# Altium schematic sheet Coil_Driver_Rev_A-PCH-2.SchDoc: PCH
size B; Author: KR; DocumentNumber: 12282021; Revision: A; SheetNumber: 3; SheetTotal: 3; PageSetup: Record=PageOptions|CenterHorizontal=True|CenterVertical=True|PrintScale=0.95|XCorrection=1.00|YCorrection=1.00|PrintKind=1|BorderSize=5000000|LeftOffset=0|BottomOffset=0|Orientation=2|PaperLength=1000|PaperWidth=1000|Scale=100|PaperSource=7|PrintQuality=-4|MediaType=1|DitherType=10|PaperKind=Letter|PrintScaleMode=1
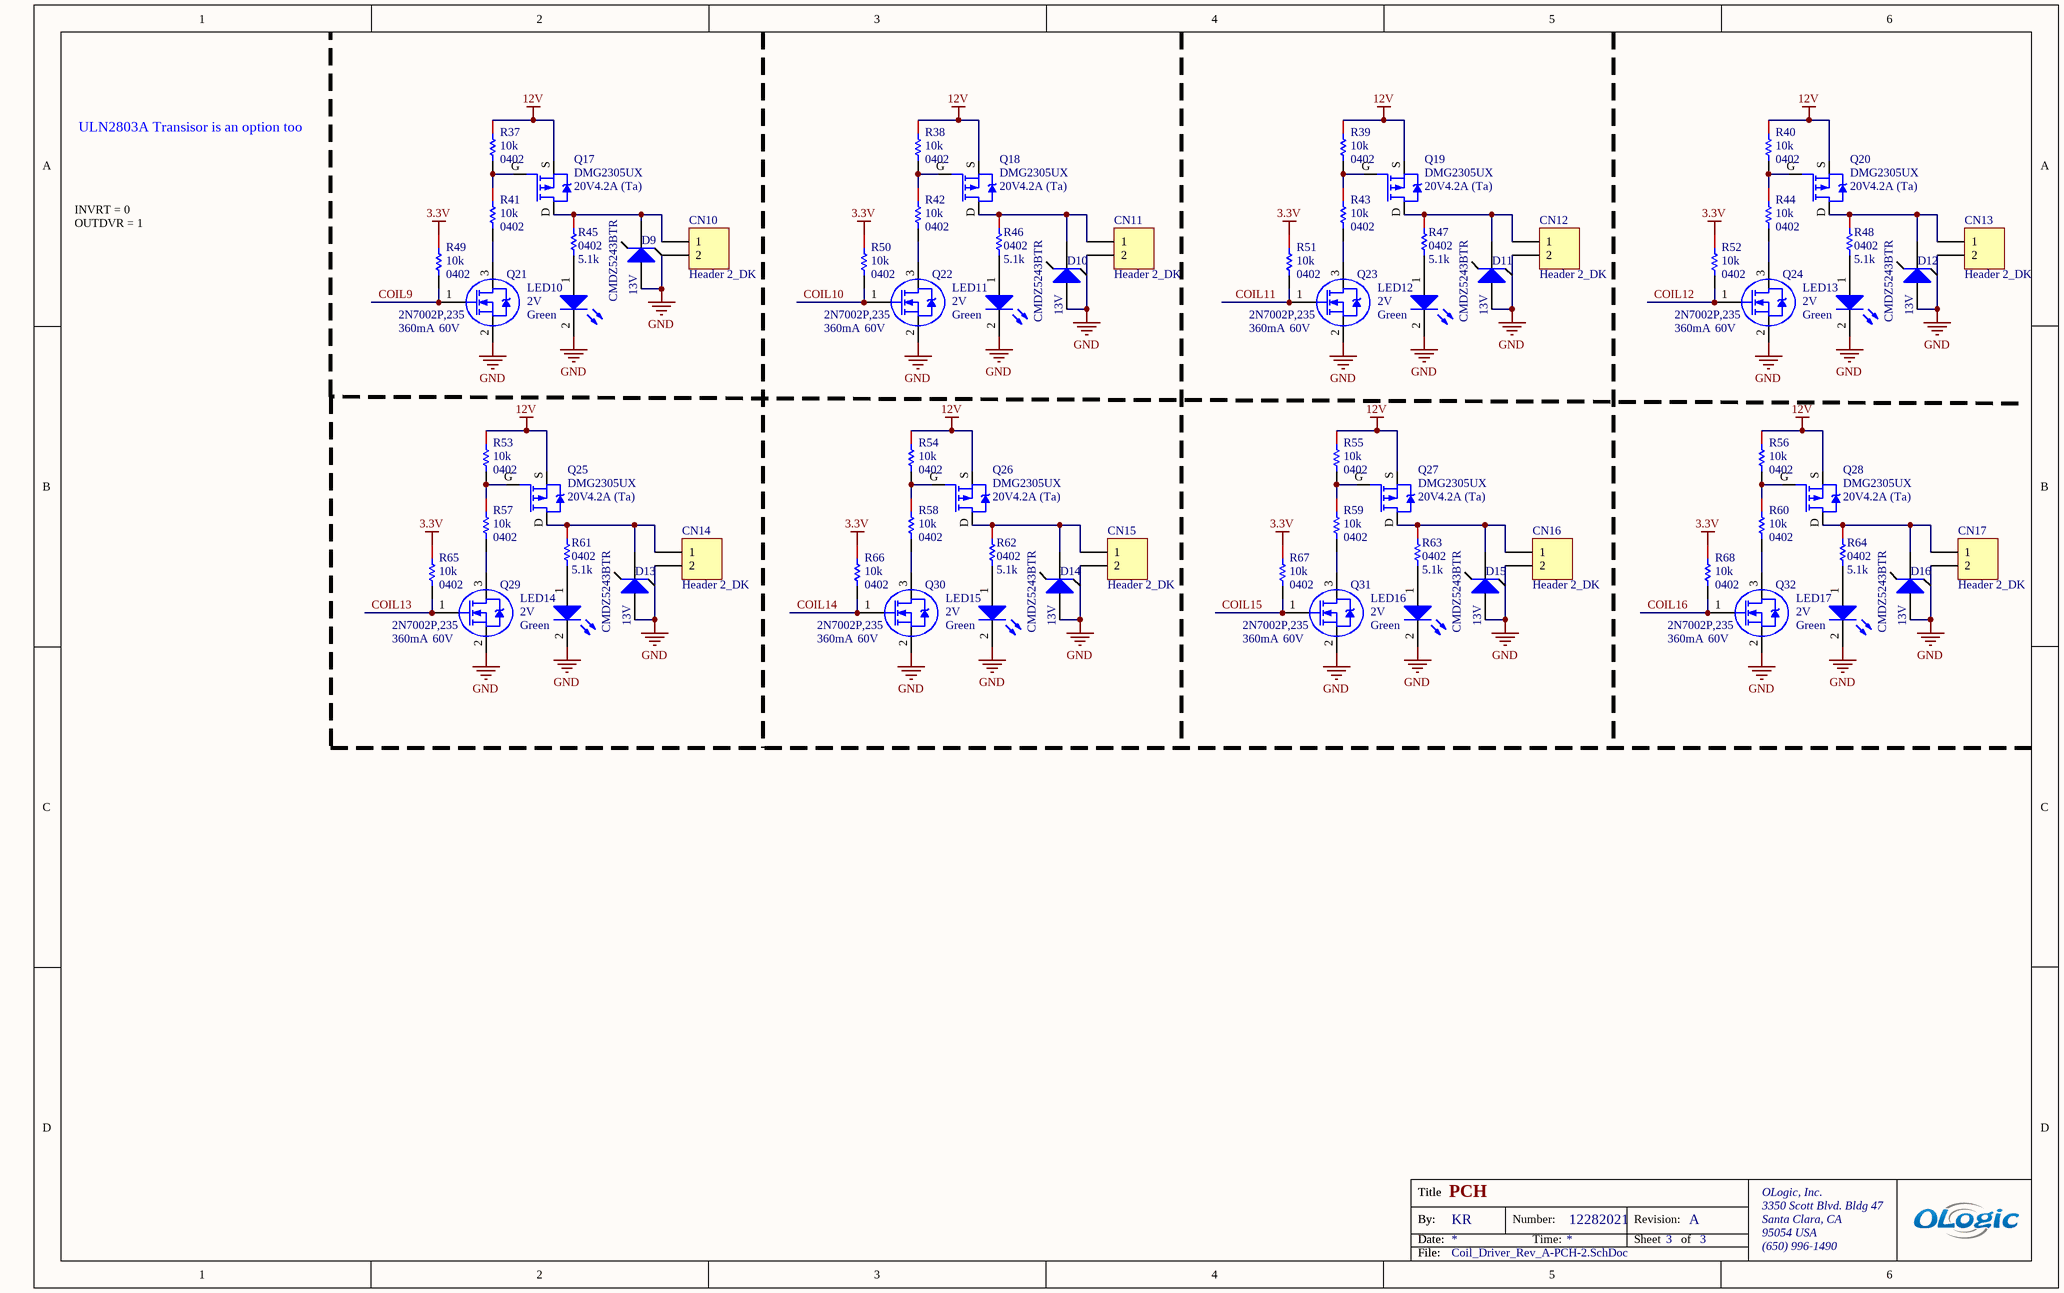
[diagram p0: Coil_Driver_Rev_A-PCH-2.SchDoc]

## Parts
CN10  Header 2_DK  [HDR1X2]
CN11  Header 2_DK  [HDR1X2]
CN12  Header 2_DK  [HDR1X2]
CN13  Header 2_DK  [HDR1X2]
CN14  Header 2_DK  [HDR1X2]
CN15  Header 2_DK  [HDR1X2]
CN16  Header 2_DK  [HDR1X2]
CN17  Header 2_DK  [HDR1X2]
D9  CMDZ5243BTR  Zener Voltage: 13V  [SOD-323]
D10  CMDZ5243BTR  Zener Voltage: 13V  [SOD-323]
D11  CMDZ5243BTR  Zener Voltage: 13V  [SOD-323]
D12  CMDZ5243BTR  Zener Voltage: 13V  [SOD-323]
D13  CMDZ5243BTR  Zener Voltage: 13V  [SOD-323]
D14  CMDZ5243BTR  Zener Voltage: 13V  [SOD-323]
D15  CMDZ5243BTR  Zener Voltage: 13V  [SOD-323]
D16  CMDZ5243BTR  Zener Voltage: 13V  [SOD-323]
LED10  Voltage - Forward (Vf) (Typ): 2V  Color: Green  [SM-LED-0603]  (hidden comment: LTST-C191KGKT)
LED11  Voltage - Forward (Vf) (Typ): 2V  Color: Green  [SM-LED-0603]  (hidden comment: LTST-C191KGKT)
LED12  Voltage - Forward (Vf) (Typ): 2V  Color: Green  [SM-LED-0603]  (hidden comment: LTST-C191KGKT)
LED13  Voltage - Forward (Vf) (Typ): 2V  Color: Green  [SM-LED-0603]  (hidden comment: LTST-C191KGKT)
LED14  Voltage - Forward (Vf) (Typ): 2V  Color: Green  [SM-LED-0603]  (hidden comment: LTST-C191KGKT)
LED15  Voltage - Forward (Vf) (Typ): 2V  Color: Green  [SM-LED-0603]  (hidden comment: LTST-C191KGKT)
LED16  Voltage - Forward (Vf) (Typ): 2V  Color: Green  [SM-LED-0603]  (hidden comment: LTST-C191KGKT)
LED17  Voltage - Forward (Vf) (Typ): 2V  Color: Green  [SM-LED-0603]  (hidden comment: LTST-C191KGKT)
Q17  DMG2305UX  Current - Continuous Drain (Id) @ 25°C: 4.2A (Ta)  Drain to Source Voltage (Vdss): 20V  [DMG2305UX-7]
Q18  DMG2305UX  Current - Continuous Drain (Id) @ 25°C: 4.2A (Ta)  Drain to Source Voltage (Vdss): 20V  [DMG2305UX-7]
Q19  DMG2305UX  Current - Continuous Drain (Id) @ 25°C: 4.2A (Ta)  Drain to Source Voltage (Vdss): 20V  [DMG2305UX-7]
Q20  DMG2305UX  Current - Continuous Drain (Id) @ 25°C: 4.2A (Ta)  Drain to Source Voltage (Vdss): 20V  [DMG2305UX-7]
Q21  2N7002P,235  Continuous Drain Current (ID): 360mA  Drain to Source Voltage (Vdss): 60V  [SOT23-3L]
Q22  2N7002P,235  Continuous Drain Current (ID): 360mA  Drain to Source Voltage (Vdss): 60V  [SOT23-3L]
Q23  2N7002P,235  Continuous Drain Current (ID): 360mA  Drain to Source Voltage (Vdss): 60V  [SOT23-3L]
Q24  2N7002P,235  Continuous Drain Current (ID): 360mA  Drain to Source Voltage (Vdss): 60V  [SOT23-3L]
Q25  DMG2305UX  Current - Continuous Drain (Id) @ 25°C: 4.2A (Ta)  Drain to Source Voltage (Vdss): 20V  [DMG2305UX-7]
Q26  DMG2305UX  Current - Continuous Drain (Id) @ 25°C: 4.2A (Ta)  Drain to Source Voltage (Vdss): 20V  [DMG2305UX-7]
Q27  DMG2305UX  Current - Continuous Drain (Id) @ 25°C: 4.2A (Ta)  Drain to Source Voltage (Vdss): 20V  [DMG2305UX-7]
Q28  DMG2305UX  Current - Continuous Drain (Id) @ 25°C: 4.2A (Ta)  Drain to Source Voltage (Vdss): 20V  [DMG2305UX-7]
Q29  2N7002P,235  Continuous Drain Current (ID): 360mA  Drain to Source Voltage (Vdss): 60V  [SOT23-3L]
Q30  2N7002P,235  Continuous Drain Current (ID): 360mA  Drain to Source Voltage (Vdss): 60V  [SOT23-3L]
Q31  2N7002P,235  Continuous Drain Current (ID): 360mA  Drain to Source Voltage (Vdss): 60V  [SOT23-3L]
Q32  2N7002P,235  Continuous Drain Current (ID): 360mA  Drain to Source Voltage (Vdss): 60V  [SOT23-3L]
R37  Resistance: 10k  Case Code (Imperial): 0402  [RESC0402(1005)_L]  (hidden comment: RES 10K OHM 0.1% 1/16W 0402)
R38  Resistance: 10k  Case Code (Imperial): 0402  [RESC0402(1005)_L]  (hidden comment: RES 10K OHM 0.1% 1/16W 0402)
R39  Resistance: 10k  Case Code (Imperial): 0402  [RESC0402(1005)_L]  (hidden comment: RES 10K OHM 0.1% 1/16W 0402)
R40  Resistance: 10k  Case Code (Imperial): 0402  [RESC0402(1005)_L]  (hidden comment: RES 10K OHM 0.1% 1/16W 0402)
R41  Resistance: 10k  Case Code (Imperial): 0402  [RESC0402(1005)_L]  (hidden comment: RES 10K OHM 0.1% 1/16W 0402)
R42  Resistance: 10k  Case Code (Imperial): 0402  [RESC0402(1005)_L]  (hidden comment: RES 10K OHM 0.1% 1/16W 0402)
R43  Resistance: 10k  Case Code (Imperial): 0402  [RESC0402(1005)_L]  (hidden comment: RES 10K OHM 0.1% 1/16W 0402)
R44  Resistance: 10k  Case Code (Imperial): 0402  [RESC0402(1005)_L]  (hidden comment: RES 10K OHM 0.1% 1/16W 0402)
R45  Package (Imperial): 0402  [RESC0402(1005)_L]  (hidden comment: 5.1K)
R46  Package (Imperial): 0402  [RESC0402(1005)_L]  (hidden comment: 5.1K)
R47  Package (Imperial): 0402  [RESC0402(1005)_L]  (hidden comment: 5.1K)
R48  Package (Imperial): 0402  [RESC0402(1005)_L]  (hidden comment: 5.1K)
R49  Resistance: 10k  Case Code (Imperial): 0402  [RESC0402(1005)_L]  (hidden comment: RES 10K OHM 0.1% 1/16W 0402)
R50  Resistance: 10k  Case Code (Imperial): 0402  [RESC0402(1005)_L]  (hidden comment: RES 10K OHM 0.1% 1/16W 0402)
R51  Resistance: 10k  Case Code (Imperial): 0402  [RESC0402(1005)_L]  (hidden comment: RES 10K OHM 0.1% 1/16W 0402)
R52  Resistance: 10k  Case Code (Imperial): 0402  [RESC0402(1005)_L]  (hidden comment: RES 10K OHM 0.1% 1/16W 0402)
R53  Resistance: 10k  Case Code (Imperial): 0402  [RESC0402(1005)_L]  (hidden comment: RES 10K OHM 0.1% 1/16W 0402)
R54  Resistance: 10k  Case Code (Imperial): 0402  [RESC0402(1005)_L]  (hidden comment: RES 10K OHM 0.1% 1/16W 0402)
R55  Resistance: 10k  Case Code (Imperial): 0402  [RESC0402(1005)_L]  (hidden comment: RES 10K OHM 0.1% 1/16W 0402)
R56  Resistance: 10k  Case Code (Imperial): 0402  [RESC0402(1005)_L]  (hidden comment: RES 10K OHM 0.1% 1/16W 0402)
R57  Resistance: 10k  Case Code (Imperial): 0402  [RESC0402(1005)_L]  (hidden comment: RES 10K OHM 0.1% 1/16W 0402)
R58  Resistance: 10k  Case Code (Imperial): 0402  [RESC0402(1005)_L]  (hidden comment: RES 10K OHM 0.1% 1/16W 0402)
R59  Resistance: 10k  Case Code (Imperial): 0402  [RESC0402(1005)_L]  (hidden comment: RES 10K OHM 0.1% 1/16W 0402)
R60  Resistance: 10k  Case Code (Imperial): 0402  [RESC0402(1005)_L]  (hidden comment: RES 10K OHM 0.1% 1/16W 0402)
R61  Package (Imperial): 0402  [RESC0402(1005)_L]  (hidden comment: 5.1K)
R62  Package (Imperial): 0402  [RESC0402(1005)_L]  (hidden comment: 5.1K)
R63  Package (Imperial): 0402  [RESC0402(1005)_L]  (hidden comment: 5.1K)
R64  Package (Imperial): 0402  [RESC0402(1005)_L]  (hidden comment: 5.1K)
R65  Resistance: 10k  Case Code (Imperial): 0402  [RESC0402(1005)_L]  (hidden comment: RES 10K OHM 0.1% 1/16W 0402)
R66  Resistance: 10k  Case Code (Imperial): 0402  [RESC0402(1005)_L]  (hidden comment: RES 10K OHM 0.1% 1/16W 0402)
R67  Resistance: 10k  Case Code (Imperial): 0402  [RESC0402(1005)_L]  (hidden comment: RES 10K OHM 0.1% 1/16W 0402)
R68  Resistance: 10k  Case Code (Imperial): 0402  [RESC0402(1005)_L]  (hidden comment: RES 10K OHM 0.1% 1/16W 0402)

## Nets
3.3V: R49.1 R50.1 R51.1 R52.1 R65.1 R66.1 R67.1 R68.1
12V: Q17.S Q18.S Q19.S Q20.S Q25.S Q26.S Q27.S Q28.S R37.1 R38.1 R39.1 R40.1 R53.1 R54.1 R55.1 R56.1
GND: CN10.2 CN11.2 CN12.2 CN13.2 CN14.2 CN15.2 CN16.2 CN17.2 D9.2(A) D10.2(A) D11.2(A) D12.2(A) D13.2(A) D14.2(A) D15.2(A) D16.2(A) LED10.2(K) LED11.2(K) LED12.2(K) LED13.2(K) LED14.2(K) LED15.2(K) LED16.2(K) LED17.2(K) Q21.2(S) Q22.2(S) Q23.2(S) Q24.2(S) Q29.2(S) Q30.2(S) Q31.2(S) Q32.2(S)
COIL9: Q21.1(G) R49.2
COIL10: Q22.1(G) R50.2
COIL11: Q23.1(G) R51.2
COIL12: Q24.1(G) R52.2
COIL13: Q29.1(G) R65.2
COIL14: Q30.1(G) R66.2
COIL15: Q31.1(G) R67.2
COIL16: Q32.1(G) R68.2
NetCN10_1: CN10.1 D9.1(K) Q17.D R45.1
NetCN11_1: CN11.1 D10.1(K) Q18.D R46.1
NetCN12_1: CN12.1 D11.1(K) Q19.D R47.1
NetCN13_1: CN13.1 D12.1(K) Q20.D R48.1
NetCN14_1: CN14.1 D13.1(K) Q25.D R61.1
NetCN15_1: CN15.1 D14.1(K) Q26.D R62.1
NetCN16_1: CN16.1 D15.1(K) Q27.D R63.1
NetCN17_1: CN17.1 D16.1(K) Q28.D R64.1
NetLED10_1: LED10.1(A) R45.2
NetLED11_1: LED11.1(A) R46.2
NetLED12_1: LED12.1(A) R47.2
NetLED13_1: LED13.1(A) R48.2
NetLED14_1: LED14.1(A) R61.2
NetLED15_1: LED15.1(A) R62.2
NetLED16_1: LED16.1(A) R63.2
NetLED17_1: LED17.1(A) R64.2
NetQ17_G: Q17.G R37.2 R41.1
NetQ18_G: Q18.G R38.2 R42.1
NetQ19_G: Q19.G R39.2 R43.1
NetQ20_G: Q20.G R40.2 R44.1
NetQ21_3: Q21.3(D) R41.2
NetQ22_3: Q22.3(D) R42.2
NetQ23_3: Q23.3(D) R43.2
NetQ24_3: Q24.3(D) R44.2
NetQ25_G: Q25.G R53.2 R57.1
NetQ26_G: Q26.G R54.2 R58.1
NetQ27_G: Q27.G R55.2 R59.1
NetQ28_G: Q28.G R56.2 R60.1
NetQ29_3: Q29.3(D) R57.2
NetQ30_3: Q30.3(D) R58.2
NetQ31_3: Q31.3(D) R59.2
NetQ32_3: Q32.3(D) R60.2

## Notes on the sheet
- ULN2803A Transisor is an option too
- INVRT = 0
  OUTDVR = 1
- Title
- By:
- Date:
- Number:
- Time:
- Revision:
- Sheet
- of
- OLogic, Inc.
- 3350 Scott Blvd. Bldg 47
- Santa Clara, CA
- 95054 USA
- File:
- (650) 996-1490

## Library data of the parts
CN10-CN17 = CMP-001-0280-01: Header, 2-Pin; Manufacturer Part Number: 826936-2; Manufacturer: TE Connectivity AMP Connectors; Number of Positions: 2; Connector Type: Header, Unshrouded, Breakaway; Number of Positions Loaded: All; Features: -; Packaging: Bulk; Component Name: Header 2_DK; Color: Green; Stock 1: 32894; ComponentLink1Description: http://www.te.com/commerce/DocumentDelivery/DDEController?Action=srchrtrv&DocNm=826629&DocType=Customer+Drawing&DocLang=English; RoHS: RoHS Compliant; Contact Type: Male Pin; Fastening Type: -; Number of Rows: 1; Designator: Header 2_DK; Termination: Solder; Part Status: Active; ComponentLink1URL: http://www.te.com/commerce/DocumentDelivery/DDEController?Action=srchrtrv&DocNm=826629&DocType=Customer+Drawing&DocLang=English; Contact Finish Thickness: 78.7µin (2.00µm); Pricing 1: 1=0.23, 10=0.211, 25=0.18, 50=0.1576, 100=0.1463, 250=0.12944, 500=0.1238, 1000=0.10129, 2500=0.09284 (USD); Row Spacing: -; Pin Count: 2; Mounting Type: Through Hole; Contact Finish: Tin
D9-D16 = CMP-001-0939-01: DIODE ZENER 13V 250MW SOD323; Tolerance: 5%; Impedance: 13R; Max Operating Temperature: 150°C; Max Power Dissipation: 250mW; Packaging: Tape and Reel; Min Operating Temperature: -65°C; Mount: Surface Mount
LED10-LED17 = CMP-001-0086-07: LED GREEN CLEAR THIN 0603 SMD; Manufacturer: Lite-On Inc; Viewing Angle: 130°; Wavelength - Peak: 574nm; Wavelength - Dominant: 571nm; Current - Test: 20mA; Millicandela Rating: 35mcd; Lens Style/Size: Rectangle with Flat Top, 1.1mm x 0.8mm; Pin Count: 2; Packaging: Cut Tape (CT); Height: 0.55mm; Size / Dimension: 1.60mm L x 0.80mm W; Mounting Type: Surface Mount; ClassName: *; RoHS: RoHS Compliant; Pricing 1: 1=0.3, 10=0.238, 100=0.1296, 250=0.0864, 500=0.07344, 1000=0.05616, 2500=0.05076 (USD); Lens Type: Clear; Manufacturer Part Number: LTST-C191KGKT; Stock 1: 84829; Package / Case: 0603 (1608 Metric)
Q17-Q20 Q25-Q28 = CMP-012-0038-02: MOSFET P-CH 20V 4.2A SOT23; Manufacturer: Diodes Incorporated; Input Capacitance (Ciss) @ Vds: 808pF @ 15V; FET Type: MOSFET P-Channel, Metal Oxide; Power - Max: 1.4W; FET Feature: Standard; Rds On (Max) @ Id, Vgs: 52 mOhm @ 4.2A, 4.5V; Gate Charge (Qg) @ Vgs: 10.2nC @ 4.5V; Vgs(th) (Max) @ Id: 900mV @ 250µA; Manufacturer Part Number: DMG2305UX-7; ComponentLink1URL: http://www.diodes.com/_files/datasheets/DMG2305UX.pdf; ComponentLink1Description: http://www.diodes.com/_files/datasheets/DMG2305UX.pdf; Pricing 1: 1=0.38, 10=0.311, 100=0.1649, 500=0.10846, 1000=0.0739 (USD); Designator: DMG2305UX; Package / Case: TO-236-3, SC-59, SOT-23-3; Supplier Device Package: SOT-23; Component Name: DMG2305UX; Creator: osman; RoHS: RoHS Compliant; Packaging: Cut Tape (CT); Operating Temperature: -55°C ~ 150°C (TJ); Pin Count: 3; Mounting Type: Surface Mount; Stock 1: 78669
Q21-Q24 Q29-Q32 = CMP-012-0002-01: MOSFET N-CH 60V 0.36A SOT-23; Manufacturer: NXP Semiconductors; FET Type: N-Channel; Drain to Source Resistance: 1.6R; Power Dissipation (Max): 350mW (Ta); Gate to Source Voltage (Vgs): 20V; Vgs (Max): ±20V; Turn-Off Delay Time: 10ns; Input Capacitance: 50pF; Current - Continuous Drain (Id) @ 25°C: 360mA (Ta); Max Power Dissipation: 350mW; Drive Voltage (Max Rds On,  Min Rds On): 10V; Rise Time: 4ns; Fall Time: 5ns; Vgs(th) (Max) @ Id: 2.4V @ 250µA; Number of Elements: 1; Power Dissipation: 420mW; Rds On (Max) @ Id, Vgs: 1.6 Ohm @ 500mA, 10V; Turn-On Delay Time: 3ns; ComponentLink7Description: https://datasheet.ciiva.com/15216/getdatasheetpartid-496132-15216636.pdf; ComponentLink2Description: https://datasheet.ciiva.com/4439/2n7002p-99415-4439248.pdf; Contact Plating: Tin; ComponentLink3URL: https://datasheet.ciiva.com/6371/2n7002p-6371141.pdf; Stock 1: 109268; FET Feature: -; Case/Package: SOT; RoHS: RoHS Compliant; ComponentLink2URL: https://datasheet.ciiva.com/4439/2n7002p-99415-4439248.pdf; ComponentLink8URL: https://datasheet.ciiva.com/46633/discretesemiconductors-46633181.pdf; Number of Pins: 3; ComponentLink1Description: http://assets.nexperia.com/documents/data-sheet/2N7002P.pdf; Pricing 1: 1=0.14, 10=0.128, 100=0.07, 500=0.043, 1000=0.0294 (USD); Mounting Type: Surface Mount; Rds On Max: 1.6R; Package Quantity: 10000; Pricing 2: 1=0.16, 10=0.148, 100=0.0969, 500=0.04738, 1000=0.03231 (USD); Lead Free: Lead Free; ComponentLink4Description: https://datasheet.ciiva.com/49067/getdatasheetpartid-765733-49067862.pdf; ComponentLink4URL: https://datasheet.ciiva.com/49067/getdatasheetpartid-765733-49067862.pdf; Packaging: Tape and Reel; Max Dual Supply Voltage: 60V; Part Status: Active; ComponentLink1URL: http://assets.nexperia.com/documents/data-sheet/2N7002P.pdf; ComponentLink7URL: https://datasheet.ciiva.com/15216/getdatasheetpartid-496132-15216636.pdf; Component Name: 2N7002P,235; Pin Count: 3; Operating Temperature: -55°C ~ 150°C (TJ); Stock 2: 177811; ComponentLink3Description: https://datasheet.ciiva.com/6371/2n7002p-6371141.pdf; ComponentLink6Description: https://datasheet.ciiva.com/26921/getdatasheetpartid-765733-26921227.pdf; ComponentLink5Description: https://datasheet.ciiva.com/11168/2n7002p-11168552.pdf; ComponentLink9URL: https://assets.nexperia.com/documents/data-sheet/2N7002P.pdf; ComponentLink8Description: https://datasheet.ciiva.com/46633/discretesemiconductors-46633181.pdf; ComponentLink6URL: https://datasheet.ciiva.com/26921/getdatasheetpartid-765733-26921227.pdf; Package / Case: TO-236-3, SC-59, SOT-23-3; Min Operating Temperature: -55°C; Radiation Hardening: No; ComponentLink5URL: https://datasheet.ciiva.com/11168/2n7002p-11168552.pdf; Manufacturer Part Number: 2N7002P,235; Drain to Source Breakdown Voltage: 60V; Supplier Device Package: TO-236AB (SOT23); Designator: 2N7002P,235; Max Operating Temperature: 150°C; ComponentLink9Description: https://assets.nexperia.com/documents/data-sheet/2N7002P.pdf; Technology: MOSFET (Metal Oxide)
R37-R44 R49-R60 R65-R68 = CMP-001-0950-02: 10 kOhms ±0.1% 0.063W, 1/16W Chip Resistor 0402 (1005 Metric) Automotive AEC-Q200 Thin Film; Temperature Coefficient: 25ppm/°C; Max Power Dissipation: 63mW; Length: 0.039inch; Max Operating Temperature: 155°C; Min Operating Temperature: -55°C; Case/Package: 0402; Packaging: Tape and Reel; Tolerance: 0.1%; Width: 0.02inch; Contact Plating: Tin,Matte; Height: 0.016inch; Composition: Thin Film; Case Code (Metric): 1005; Package Quantity: 10000; Mount: Surface Mount; Radiation Hardening: No; Number of Terminations: 2; Features: Moisture Resistant
R45-R48 R61-R64 = CMP-007-0525-15: RES SMD 5.1K OHM 1% 1/10W 0402; Package (Metric): 1005; Max Power Dissipation: 100mW; Voltage Rating (DC): 50V; Power: 63mW; Temperature Coefficient: 100ppm/°C; Resistance: 5.1k; Termination: SMD/SMT; Lead Free: Lead Free; Mount: Surface Mount; Length: 1mm; Width: 500µm; Min Operating Temperature: -55°C; Contact Plating: Tin; Weight: 2.8E-05oz; Voltage Rating: 50V; Height: 350µm; Depth: 0.5mm; Military Standard: Not; Composition: Thick Film; Number of Terminations: 2; Packaging: Tape and Reel; Power Rating: 100mW; Tolerance: 1%; Package Quantity: 10000; Max Operating Temperature: 155°C; REACH SVHC: No SVHC